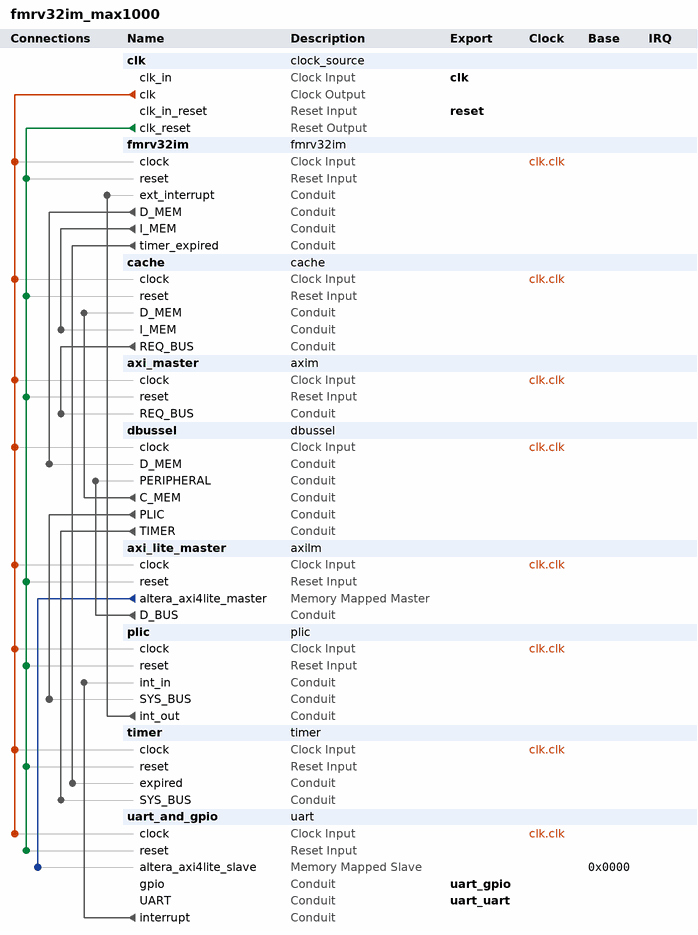
[diagram p0: system contents]
# Platform Designer (Qsys) system fmrv32im_max1000, MAX 10 10M08SAU169C8G
# Parameters at their usual value, and those the tool derives, are not listed.
package require -exact qsys 18.1
create_system fmrv32im_max1000
set_project_property DEVICE_FAMILY {MAX 10}
set_project_property DEVICE 10M08SAU169C8G

add_instance clk clock_source 18.1
set_instance_parameter_value clk clockFrequency 48000000

add_instance fmrv32im fmrv32im 1.0

add_instance cache cache 1.0
set_instance_parameter_value cache INTEL 1
set_instance_parameter_value cache MEM_FILE /home/vagrant/develop/max1000/FPGAMAG18-1/romdata/max1000.mif
set_instance_parameter_value cache OSRAM 0

add_instance axi_master axim 1.0

add_instance dbussel dbussel 1.0

add_instance axi_lite_master axilm 1.0

add_instance plic plic 1.0

add_instance timer timer 1.0

add_instance uart_and_gpio uart 1.0
set_instance_parameter_value uart_and_gpio RESET_COUNT 51

# connections
add_connection clk.clk axi_lite_master.clock clock
add_connection clk.clk axi_master.clock clock
add_connection clk.clk cache.clock clock
add_connection clk.clk dbussel.clock clock
add_connection clk.clk fmrv32im.clock clock
add_connection clk.clk plic.clock clock
add_connection clk.clk timer.clock clock
add_connection clk.clk uart_and_gpio.clock clock
add_connection clk.clk_reset axi_lite_master.reset reset
add_connection clk.clk_reset axi_master.reset reset
add_connection clk.clk_reset cache.reset reset
add_connection clk.clk_reset fmrv32im.reset reset
add_connection clk.clk_reset plic.reset reset
add_connection clk.clk_reset timer.reset reset
add_connection clk.clk_reset uart_and_gpio.reset reset
add_connection axi_lite_master.altera_axi4lite_master uart_and_gpio.altera_axi4lite_slave avalon
set_connection_parameter_value axi_lite_master.altera_axi4lite_master/uart_and_gpio.altera_axi4lite_slave baseAddress 0x0000
add_connection axi_lite_master.D_BUS dbussel.PERIPHERAL conduit
add_connection cache.REQ_BUS axi_master.REQ_BUS conduit
add_connection dbussel.C_MEM cache.D_MEM conduit
add_connection dbussel.PLIC plic.SYS_BUS conduit
add_connection dbussel.TIMER timer.SYS_BUS conduit
add_connection fmrv32im.D_MEM dbussel.D_MEM conduit
add_connection fmrv32im.I_MEM cache.I_MEM conduit
add_connection fmrv32im.timer_expired timer.expired conduit
add_connection plic.int_out fmrv32im.ext_interrupt conduit
add_connection uart_and_gpio.interrupt plic.int_in conduit

# exported interfaces
add_interface clk clock sink
set_interface_property clk EXPORT_OF clk.clk_in
add_interface reset reset sink
set_interface_property reset EXPORT_OF clk.clk_in_reset
add_interface uart_gpio conduit end
set_interface_property uart_gpio EXPORT_OF uart_and_gpio.gpio
add_interface uart_uart conduit end
set_interface_property uart_uart EXPORT_OF uart_and_gpio.UART

set_interconnect_requirement {$system} qsys_mm.clockCrossingAdapter HANDSHAKE
set_interconnect_requirement {$system} qsys_mm.enableEccProtection FALSE
set_interconnect_requirement {$system} qsys_mm.insertDefaultSlave FALSE
set_interconnect_requirement {$system} qsys_mm.maxAdditionalLatency 1

save_system fmrv32im_max1000.qsys
